# EAGLE design amp1_psu_v0001 (EAGLE 6.4)

## Sheet 1 of 2
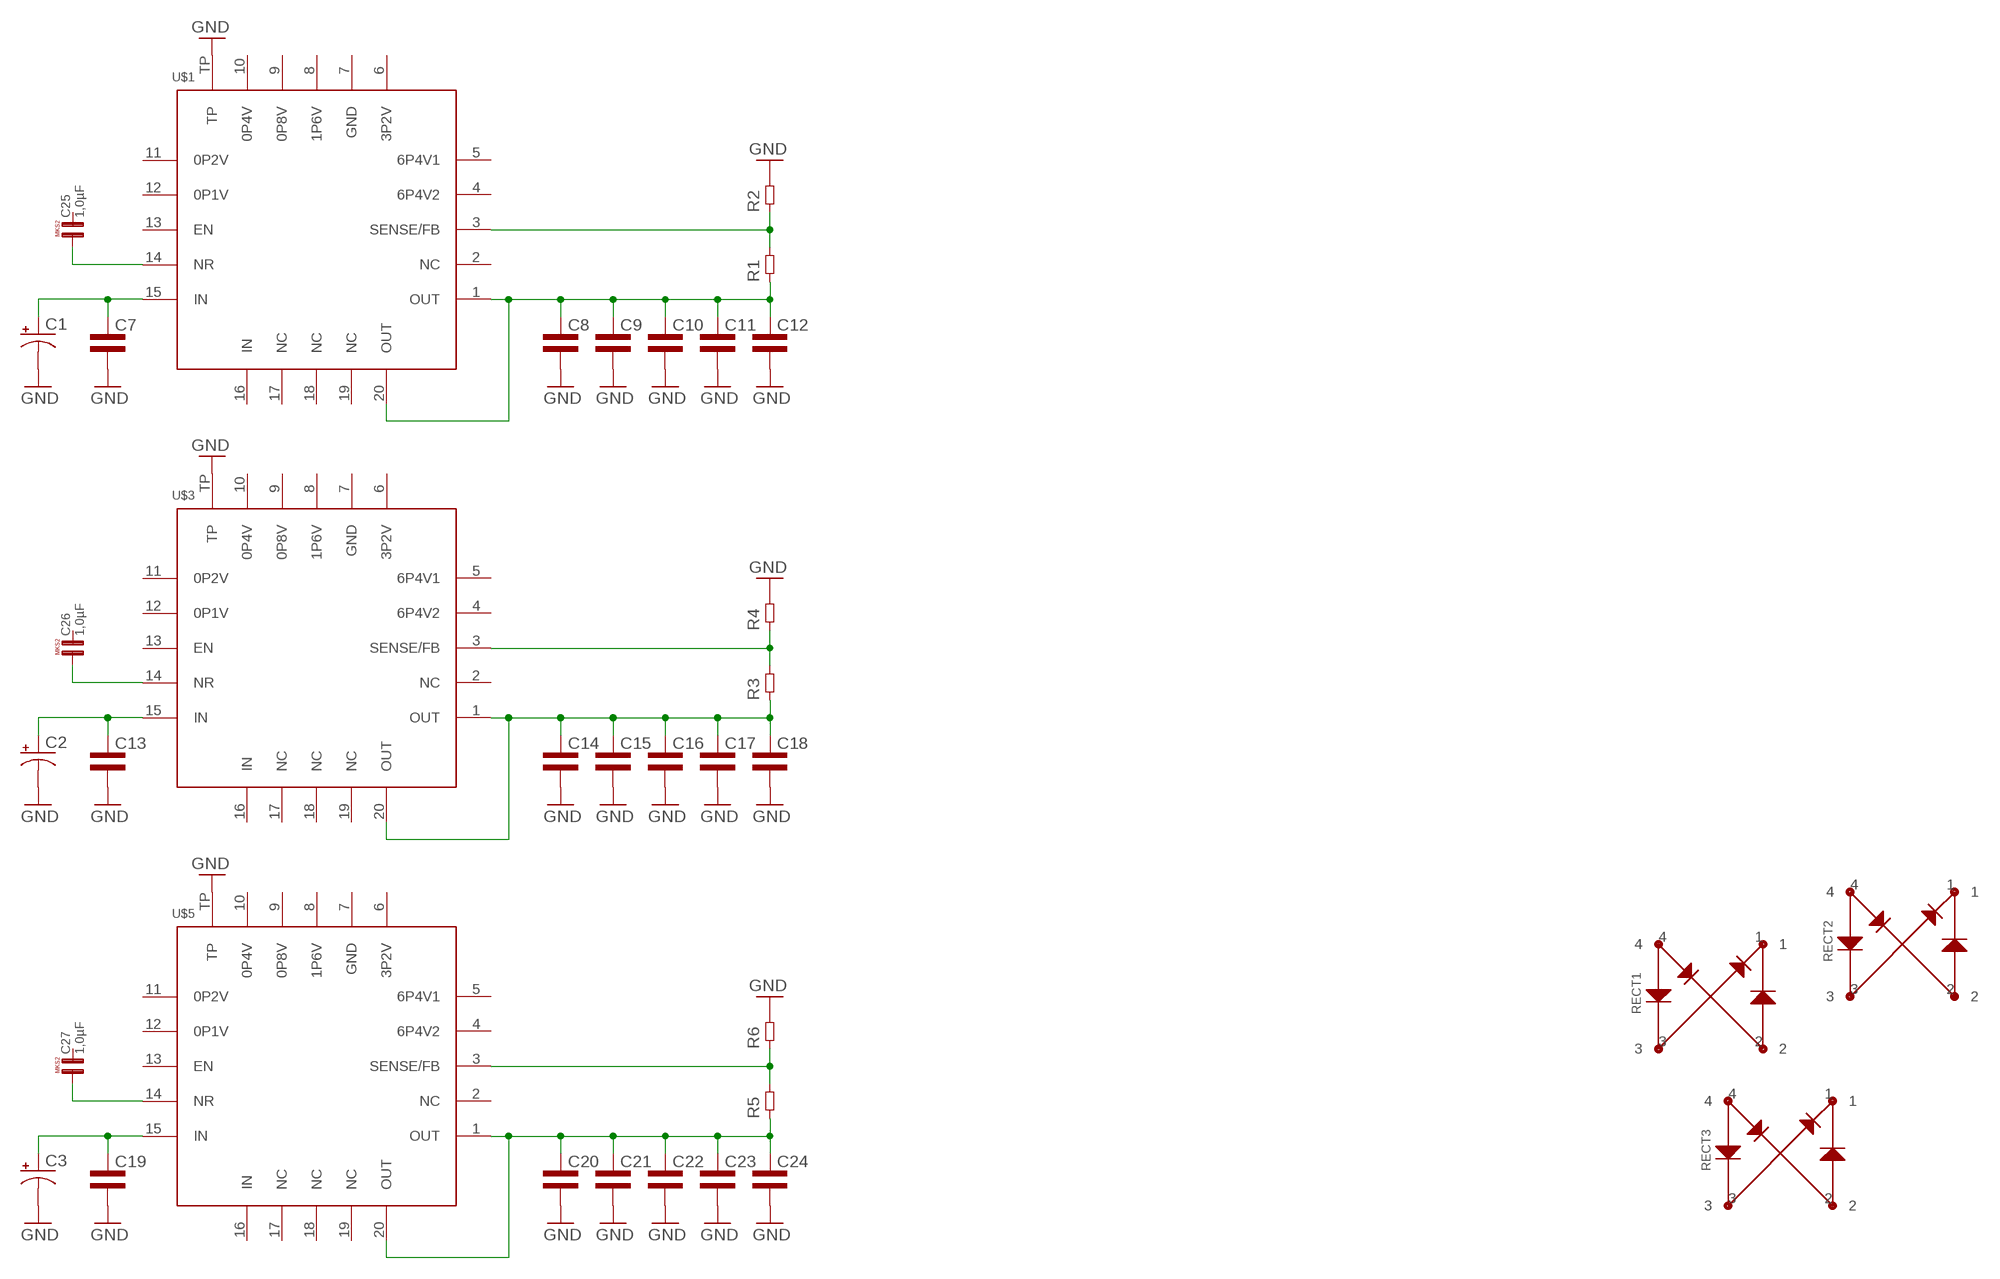
[diagram p0: schematic, sheet 1]

### Parts
C1  CPOL-USE7.5-18  [E7,5-18]
C2  CPOL-USE7.5-18  [E7,5-18]
C3  CPOL-USE7.5-18  [E7,5-18]
C7  CAP0805L3  [0805L3]
C8  CAP0805L3  [0805L3]
C9  CAP0805L3  [0805L3]
C10  CAP0805L3  [0805L3]
C11  CAP0805L3  [0805L3]
C12  CAP0805L3  [0805L3]
C13  CAP0805L3  [0805L3]
C14  CAP0805L3  [0805L3]
C15  CAP0805L3  [0805L3]
C16  CAP0805L3  [0805L3]
C17  CAP0805L3  [0805L3]
C18  CAP0805L3  [0805L3]
C19  CAP0805L3  [0805L3]
C20  CAP0805L3  [0805L3]
C21  CAP0805L3  [0805L3]
C22  CAP0805L3  [0805L3]
C23  CAP0805L3  [0805L3]
C24  CAP0805L3  [0805L3]
C25  1,0µF  [R5B5]
C26  1,0µF  [R5B5]
C27  1,0µF  [R5B5]
R1  RES0805L3  [0805L3]
R2  RES0805L3  [0805L3]
R3  RES0805L3  [0805L3]
R4  RES0805L3  [0805L3]
R5  RES0805L3  [0805L3]
R6  RES0805L3  [0805L3]
RECT1  RECTIFIER_Z4GP206  [RECTIFIER_ABS-4]
RECT2  RECTIFIER_Z4GP206  [RECTIFIER_ABS-4]
RECT3  RECTIFIER_Z4GP206  [RECTIFIER_ABS-4]
U$1  POWER-SUPPLY_POS_V1_TI_LDO_TPS7A4700  [POWER-SUPPLY_POS_V1_TI_LDO_VQFN-20]
U$3  POWER-SUPPLY_POS_V1_TI_LDO_TPS7A4700  [POWER-SUPPLY_POS_V1_TI_LDO_VQFN-20]
U$5  POWER-SUPPLY_POS_V1_TI_LDO_TPS7A4700  [POWER-SUPPLY_POS_V1_TI_LDO_VQFN-20]

### Nets
GND: C1.- C2.- C3.- C7.2 C8.2 C9.2 C10.2 C11.2 C12.2 C13.2 C14.2 C15.2 C16.2 C17.2 C18.2 C19.2 C20.2 C21.2 C22.2 C23.2 C24.2 R2.2 R4.2 R6.2 U$1.TP U$3.TP U$5.TP ; also sheet 2
N$13: C1.+ C7.1 U$1.15(IN)
N$14: C8.1 C9.1 C10.1 C11.1 C12.1 R1.1 U$1.1(OUT) U$1.20(OUT)
N$15: C2.+ C13.1 U$3.15(IN)
N$16: C14.1 C15.1 C16.1 C17.1 C18.1 R3.1 U$3.1(OUT) U$3.20(OUT)
N$17: C3.+ C19.1 U$5.15(IN)
N$18: C20.1 C21.1 C22.1 C23.1 C24.1 R5.1 U$5.1(OUT) U$5.20(OUT)
N$19: R3.2 R4.1 U$3.3(SENSE/FB)
N$20: R5.2 R6.1 U$5.3(SENSE/FB)
N$21: R1.2 R2.1 U$1.3(SENSE/FB)
N$22: C25.1 U$1.14(NR)
N$23: C26.1 U$3.14(NR)
N$24: C27.1 U$5.14(NR)
Unconnected: C25.2 C26.2 C27.2 RECT1.1 RECT1.2 RECT1.3 RECT1.4 RECT2.1 RECT2.2 RECT2.3 RECT2.4 RECT3.1 RECT3.2 RECT3.3 RECT3.4 U$1.2(NC) U$1.4(6P4V2) U$1.5(6P4V1) U$1.6(3P2V) U$1.7(GND) U$1.8(1P6V) U$1.9(0P8V) U$1.10(0P4V) U$1.11(0P2V) U$1.12(0P1V) U$1.13(EN) U$1.16(IN) U$1.17(NC) U$1.18(NC) U$1.19(NC) U$3.2(NC) U$3.4(6P4V2) U$3.5(6P4V1) U$3.6(3P2V) U$3.7(GND) U$3.8(1P6V) U$3.9(0P8V) U$3.10(0P4V) U$3.11(0P2V) U$3.12(0P1V) U$3.13(EN) U$3.16(IN) U$3.17(NC) U$3.18(NC) U$3.19(NC) U$5.2(NC) U$5.4(6P4V2) U$5.5(6P4V1) U$5.6(3P2V) U$5.7(GND) U$5.8(1P6V) U$5.9(0P8V) U$5.10(0P4V) U$5.11(0P2V) U$5.12(0P1V) U$5.13(EN) U$5.16(IN) U$5.17(NC) U$5.18(NC) U$5.19(NC)

## Sheet 2 of 2
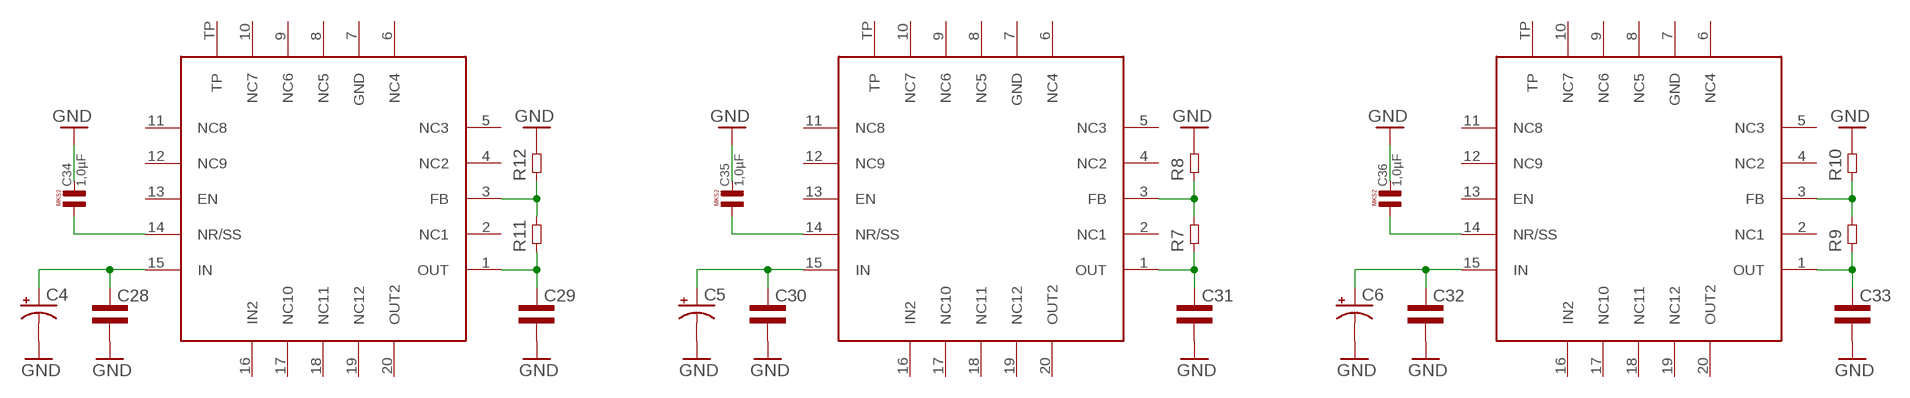
[diagram p1: schematic, sheet 2]

### Parts
C4  CPOL-USE7.5-18  [E7,5-18]
C5  CPOL-USE7.5-18  [E7,5-18]
C6  CPOL-USE7.5-18  [E7,5-18]
C28  CAP0805L3  [0805L3]
C29  CAP0805L3  [0805L3]
C30  CAP0805L3  [0805L3]
C31  CAP0805L3  [0805L3]
C32  CAP0805L3  [0805L3]
C33  CAP0805L3  [0805L3]
C34  1,0µF  [R5B5]
C35  1,0µF  [R5B5]
C36  1,0µF  [R5B5]
R7  RES0805L3  [0805L3]
R8  RES0805L3  [0805L3]
R9  RES0805L3  [0805L3]
R10  RES0805L3  [0805L3]
R11  RES0805L3  [0805L3]
R12  RES0805L3  [0805L3]
U$6  POWER-SUPPLY_POS_V1_TI_LDO_TPS7A3301RGWT  [POWER-SUPPLY_POS_V1_TI_LDO_VQFN-20]
U$7  POWER-SUPPLY_POS_V1_TI_LDO_TPS7A3301RGWT  [POWER-SUPPLY_POS_V1_TI_LDO_VQFN-20]
U$8  POWER-SUPPLY_POS_V1_TI_LDO_TPS7A3301RGWT  [POWER-SUPPLY_POS_V1_TI_LDO_VQFN-20]

### Nets
GND: C4.- C5.- C6.- C28.2 C29.2 C30.2 C31.2 C32.2 C33.2 C34.2 C35.2 C36.2 R8.2 R10.2 R12.2 ; also sheet 1
N$25: C4.+ C28.1 U$6.15(IN)
N$26: C29.1 R11.1 U$6.1(OUT)
N$27: C5.+ C30.1 U$7.15(IN)
N$28: C31.1 R7.1 U$7.1(OUT)
N$29: C6.+ C32.1 U$8.15(IN)
N$30: C33.1 R9.1 U$8.1(OUT)
N$31: R11.2 R12.1 U$6.3(FB)
N$32: R7.2 R8.1 U$7.3(FB)
N$33: R9.2 R10.1 U$8.3(FB)
N$34: C34.1 U$6.14(NR/SS)
N$35: C35.1 U$7.14(NR/SS)
N$36: C36.1 U$8.14(NR/SS)
Unconnected: U$6.2(NC1) U$6.4(NC2) U$6.5(NC3) U$6.6(NC4) U$6.7(GND) U$6.8(NC5) U$6.9(NC6) U$6.10(NC7) U$6.11(NC8) U$6.12(NC9) U$6.13(EN) U$6.16(IN2) U$6.17(NC10) U$6.18(NC11) U$6.19(NC12) U$6.20(OUT2) U$6.TP U$7.2(NC1) U$7.4(NC2) U$7.5(NC3) U$7.6(NC4) U$7.7(GND) U$7.8(NC5) U$7.9(NC6) U$7.10(NC7) U$7.11(NC8) U$7.12(NC9) U$7.13(EN) U$7.16(IN2) U$7.17(NC10) U$7.18(NC11) U$7.19(NC12) U$7.20(OUT2) U$7.TP U$8.2(NC1) U$8.4(NC2) U$8.5(NC3) U$8.6(NC4) U$8.7(GND) U$8.8(NC5) U$8.9(NC6) U$8.10(NC7) U$8.11(NC8) U$8.12(NC9) U$8.13(EN) U$8.16(IN2) U$8.17(NC10) U$8.18(NC11) U$8.19(NC12) U$8.20(OUT2) U$8.TP

## Library data of the parts
C1-C6 = rcl:CPOL-US: POLARIZED CAPACITOR, American symbol
C7-C24 C28-C33 = common:CAP
C25-C27 C34-C36 = Capacitor-Wima-MKS2-63v:1,0µF
R1-R12 = common:RES
RECT1-RECT3 = my_dac_amp:RECTIFIER_Z4GP206
U$1 U$3 U$5 = my_dac_amp:POWER-SUPPLY_POS_V1_TI_LDO_TPS7A4700
U$6-U$8 = my_dac_amp:POWER-SUPPLY_POS_V1_TI_LDO_TPS7A3301RGWT: Ultra-Low Noise NEGATIVE Voltage Reglator

## Board
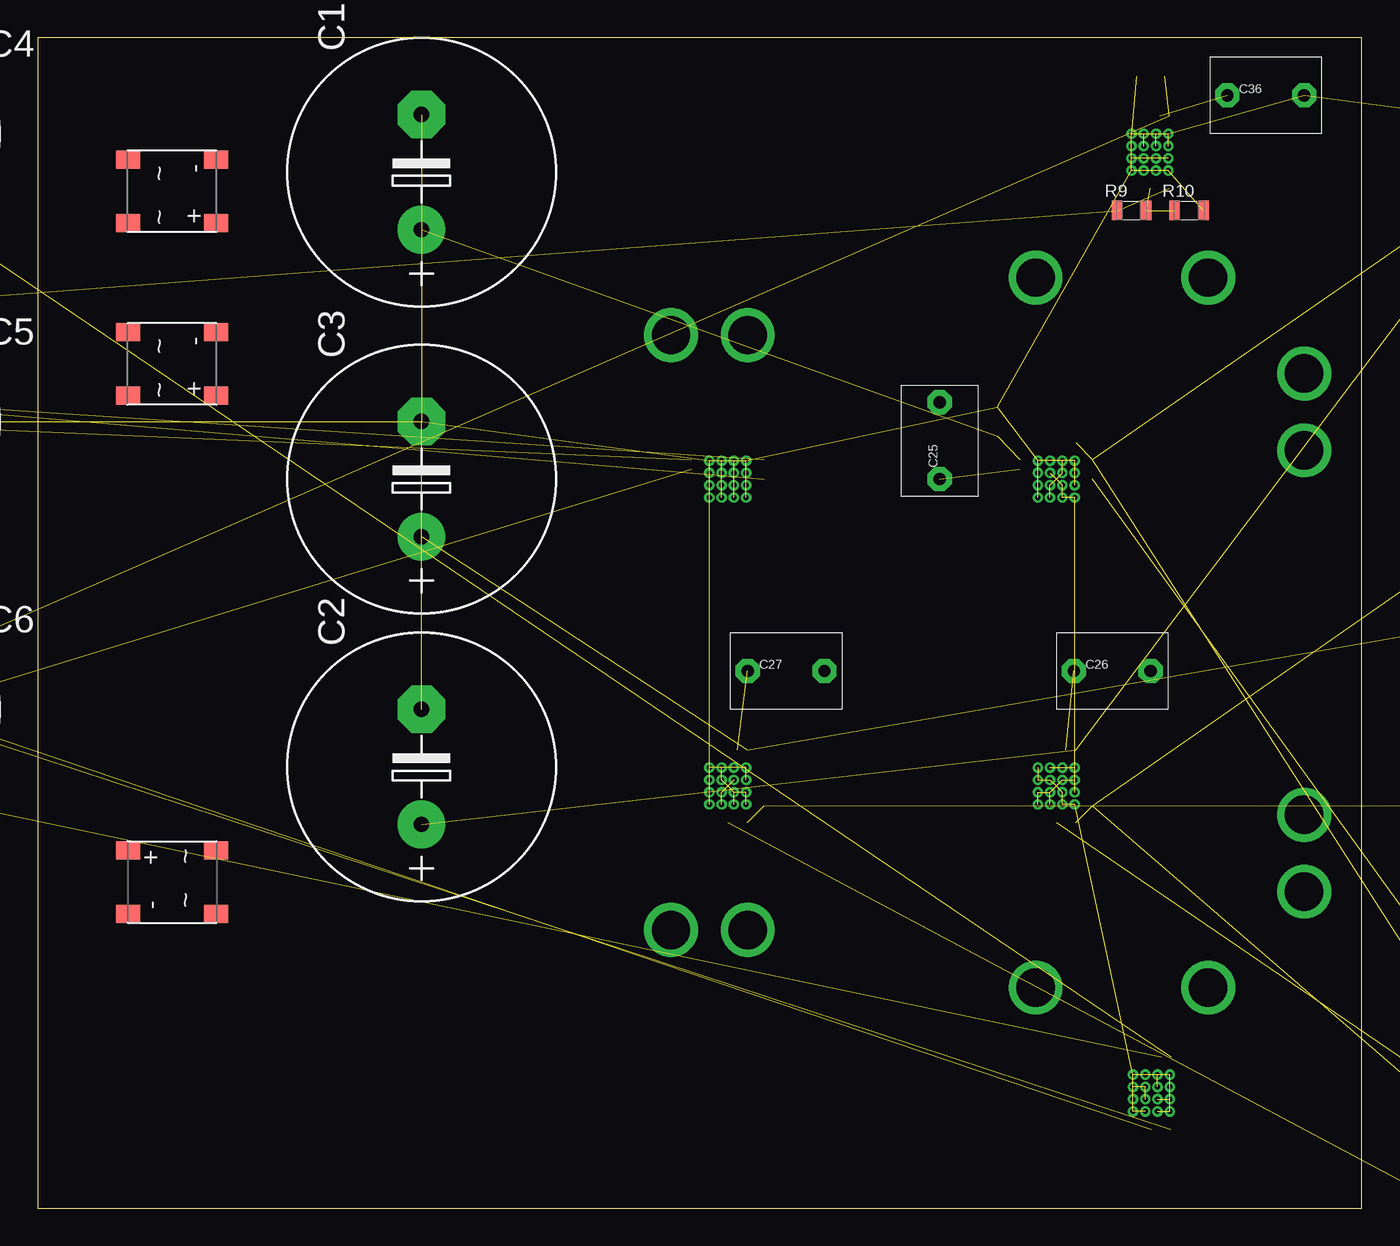
[diagram p2: board, top side]
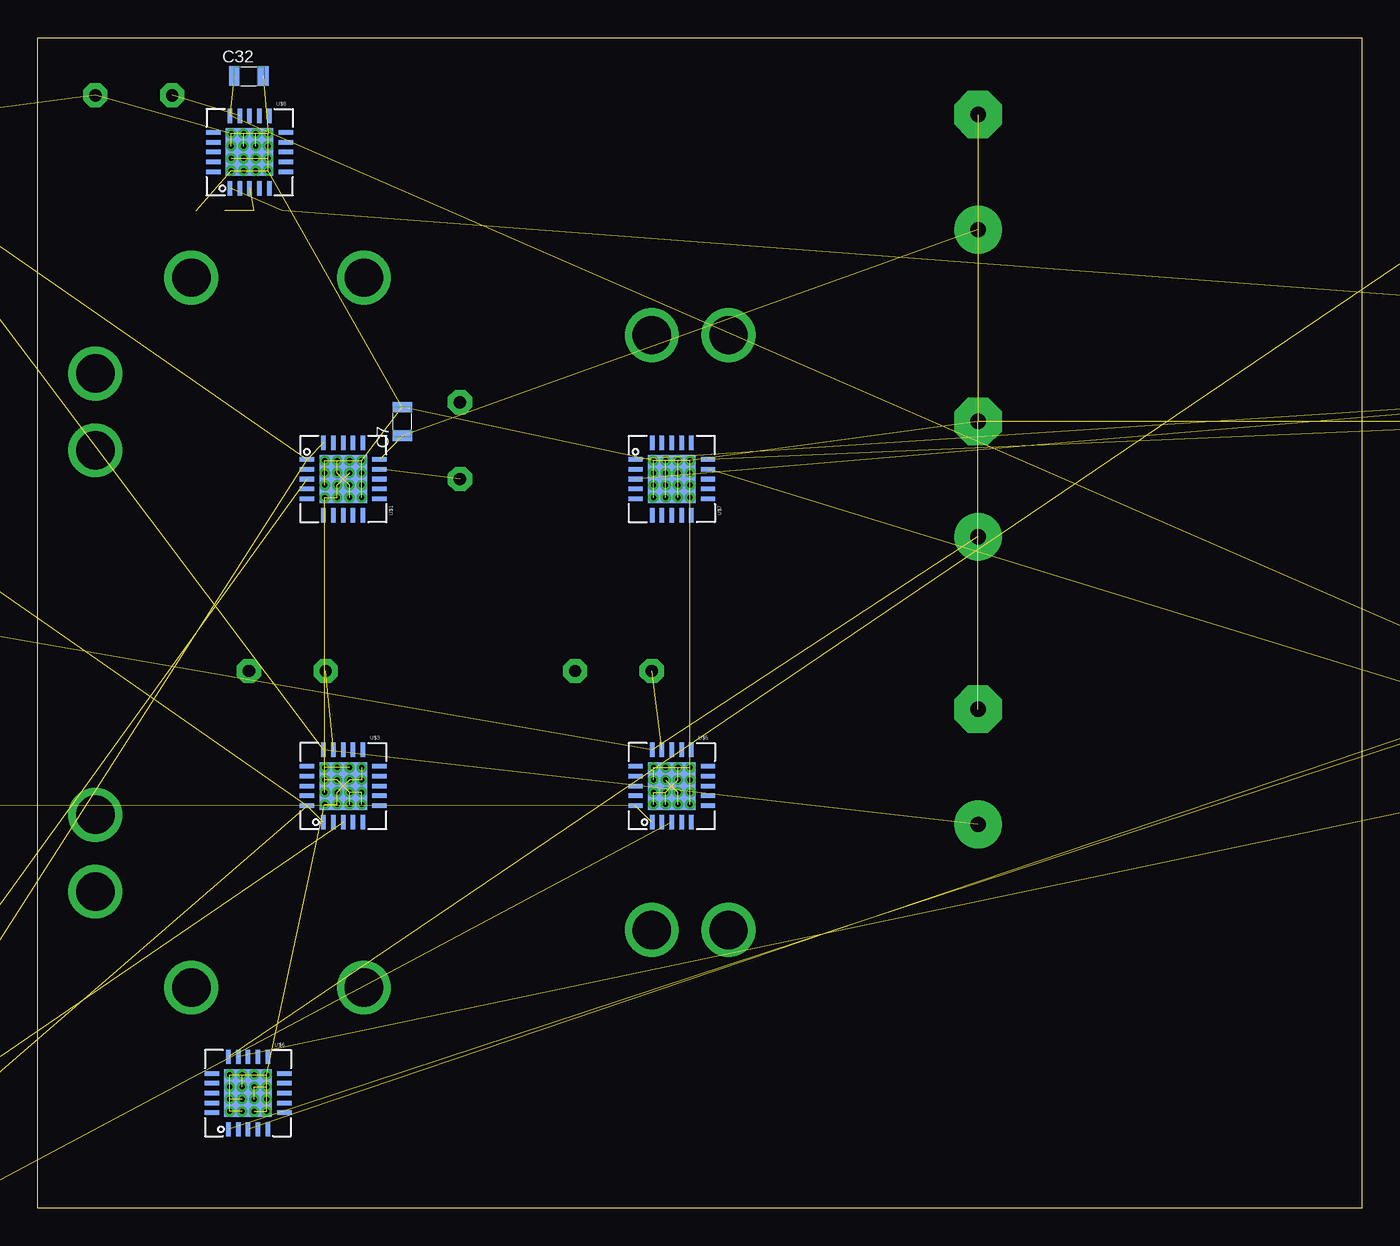
[diagram p3: board, bottom side, seen from below]

Size 87.63 x 77.47 mm. Coordinates in mm from the lower left corner, seen from the top.
Outline: 0,0 87.63,0 87.63,77.47 0,77.47 0,0
Copper layers (1*16): Top 0.035mm / dielectric 1.5mm / Bottom 0.035mm
Design rules "default *": minimum track width 6mil, minimum drill 13mil, track to track 8mil, track to pad 8mil, pad to pad 8mil, via to via 8mil, smd to smd 8mil, copper to edge 16mil, drill to drill 8mil, minimum pad ring 7mil, minimum via ring 7mil, stop-mask expansion 4mil, vias tented up to drill 21mil, thermal gap 10mil

### Footprints (pad centres in the part's own frame; a part is rotated, then mirrored left to right if it is on the bottom)
E7,5-18 = drill 1.016 pad 3.15: + -3.81,0 | drill 1.016 pad 3.15 octagon: - 3.81,0
0805L3 = smd 0.7 x 1.3: 1 -0.95,0; 2 0.95,0
R5B5 = drill 0.813 pad 1.6 octagon: 1 -2.54,0; 2 2.54,0
RECTIFIER_ABS-4 = smd 1.2 x 1.6: 1 2.1,2.91; 2 2.1,-2.91; 3 -2.1,-2.91; 4 -2.1,2.91
POWER-SUPPLY_POS_V1_TI_LDO_VQFN-20 = smd 0.3 x 0.95: 1 -1.3,-2.4; 2 -0.65,-2.4; 3 0,-2.4; 4 0.65,-2.4; 5 1.3,-2.4; 11 1.3,2.4; 12 0.65,2.4; 13 0,2.4; 14 -0.65,2.4; 15 -1.3,2.4 | smd 0.95 x 0.3: 6 2.4,-1.3; 7 2.4,-0.65; 8 2.4,0; 9 2.4,0.65; 10 2.4,1.3; 16 -2.4,1.3; 17 -2.4,0.65; 18 -2.4,0; 19 -2.4,-0.65; 20 -2.4,-1.3 | smd 3.15 x 3.15: TP 0,0

### Placement (x,y rotation side)
C1  25.4,68.58 90 top
C2  25.4,29.21 90 top
C3  25.4,48.26 90 top
C4  -11.43,71.12 0 top  (outside the outline)
C5  -11.43,52.07 0 top  (outside the outline)
C6  -11.43,33.02 0 top  (outside the outline)
C7  63.5,52.07 90 bottom
C8  92.71,80.01 0 top  (outside the outline)
C9  92.71,76.2 0 top  (outside the outline)
C10  92.71,72.39 0 top  (outside the outline)
C11  93.98,68.58 0 top  (outside the outline)
C12  92.71,64.77 0 top  (outside the outline)
C13  92.71,60.96 0 top  (outside the outline)
C14  92.71,57.15 0 top  (outside the outline)
C15  92.71,53.34 0 top  (outside the outline)
C16  92.71,49.53 0 top  (outside the outline)
C17  92.71,45.72 0 top  (outside the outline)
C18  92.71,41.91 0 top  (outside the outline)
C19  92.71,38.1 0 top  (outside the outline)
C20  92.71,34.29 0 top  (outside the outline)
C21  92.71,30.48 0 top  (outside the outline)
C22  92.71,26.67 0 top  (outside the outline)
C23  92.71,22.86 0 top  (outside the outline)
C24  92.71,19.05 0 top  (outside the outline)
C25  59.69,50.8 90 top
C26  71.12,35.56 0 top
C27  49.53,35.56 0 top
C28  -27.94,77.47 0 top  (outside the outline)
C29  -27.94,73.66 0 top  (outside the outline)
C30  -27.94,69.85 0 top  (outside the outline)
C31  -27.94,66.04 0 top  (outside the outline)
C32  73.66,74.93 0 bottom
C33  -27.94,58.42 0 top  (outside the outline)
C34  -26.67,31.75 0 top  (outside the outline)
C35  -26.67,26.67 0 top  (outside the outline)
C36  81.28,73.66 0 top
R1  92.71,15.24 0 top  (outside the outline)
R2  92.71,11.43 0 top  (outside the outline)
R3  92.71,7.62 0 top  (outside the outline)
R4  92.71,3.81 0 top  (outside the outline)
R5  92.71,0 0 top  (outside the outline)
R6  92.71,-3.81 0 top  (outside the outline)
R7  -27.94,54.61 0 top  (outside the outline)
R8  -27.94,50.8 0 top  (outside the outline)
R9  72.39,66.04 0 top
R10  76.2,66.04 0 top
R11  -27.94,39.37 0 top  (outside the outline)
R12  -27.94,35.56 0 top  (outside the outline)
RECT1  8.89,67.31 270 top
RECT2  8.89,55.88 270 top
RECT3  8.89,21.59 90 top
U$1  67.41,48.26 270 bottom
U$3  67.41,27.94 0 bottom
U$5  45.67,27.94 0 bottom
U$6  73.71,7.62 0 bottom
U$7  45.67,48.26 270 bottom
U$8  73.61,69.9 0 bottom

### Tracks (layer width: path | path; a pad name or v marks a point on that pad's centre or on a via)
GND  (via drill 0.33)  (137 unrouted)
  other vias: 44.45,49.48 45.26,49.48 46.08,49.48 46.89,49.48 44.45,48.67 45.26,48.67 46.08,48.67 46.89,48.67 46.89,47.85 46.08,47.85 45.26,47.85 44.45,47.85 44.45,47.04 45.26,47.04 46.08,47.04 46.89,47.04 44.45,29.16 45.26,29.16 46.08,29.16 46.89,29.16 44.45,28.35 45.26,28.35 46.08,28.35 46.89,28.35 44.45,27.53 44.45,26.72 45.26,27.53 46.08,27.53 46.89,27.53 45.26,26.72 46.08,26.72 46.89,26.72 72.39,71.12 66.19,49.48 66.19,29.16 72.49,8.84 73.2,71.12 74.02,71.12 74.83,71.12 72.39,70.31 72.39,69.49 72.39,68.68 73.2,70.31 73.2,69.49 73.2,68.68 74.02,68.68 74.02,69.49 74.02,70.31 74.83,70.31 74.83,69.49 74.83,68.68 66.19,48.67 66.19,47.85 66.19,47.04 67.01,49.48 67.01,48.67 67.01,47.85 67.01,47.04 67.82,47.04 68.63,47.04 68.63,47.85 68.63,48.67 68.63,49.48 67.82,49.48 67.82,48.67 67.82,47.85 66.19,28.35 66.19,27.53 66.19,26.72 67.01,26.72 67.82,26.72 68.63,26.72 68.63,27.53 68.63,28.35 68.63,29.16 67.82,29.16 67.01,29.16 67.01,28.35 67.01,27.53 67.82,27.53 67.82,28.35 72.49,8.03 72.49,7.21 72.49,6.4 73.3,6.4 74.12,6.4 74.93,6.4 74.93,7.21 74.93,8.03 74.93,8.84 74.12,8.84 73.3,8.84 73.3,8.03 73.3,7.21 74.12,7.21 74.12,8.03
N$1  (via drill 2.54)
  other vias: 41.91,57.78
N$2  (via drill 2.54)
  other vias: 46.99,57.78
N$3  (via drill 2.54)
  other vias: 41.91,18.42
N$4  (via drill 2.54)
  other vias: 46.99,18.42
N$5  (via drill 2.54)
  other vias: 66.04,61.59
N$6  (via drill 2.54)
  other vias: 77.47,61.59
N$7  (via drill 2.54)
  other vias: 83.82,55.24
N$8  (via drill 2.54)
  other vias: 83.82,50.16
N$9  (via drill 2.54)
  other vias: 66.04,14.61
N$10  (via drill 2.54)
  other vias: 77.47,14.61
N$11  (via drill 2.54)
  other vias: 83.82,20.96
N$12  (via drill 2.54)
  other vias: 83.82,26.04
N$13  (2 unrouted)
N$14  (7 unrouted)
N$15  (2 unrouted)
N$16  (7 unrouted)
N$17  (2 unrouted)
N$18  (7 unrouted)
N$19  (2 unrouted)
N$20  (2 unrouted)
N$21  (2 unrouted)
N$22  (1 unrouted)
N$23  (1 unrouted)
N$24  (1 unrouted)
N$25  (2 unrouted)
N$26  (2 unrouted)
N$27  (2 unrouted)
N$28  (2 unrouted)
N$29  (2 unrouted)
N$30  (2 unrouted)
N$31  (2 unrouted)
N$32  (2 unrouted)
N$33  (2 unrouted)
N$34  (1 unrouted)
N$35  (1 unrouted)
N$36  (1 unrouted)